# Altium schematic sheet Common_Mode_Filter.SchDoc
size A4
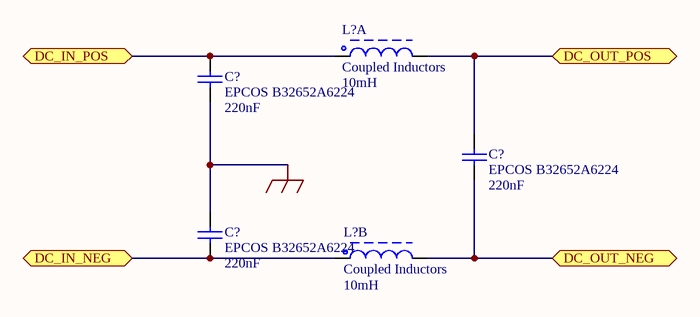
[diagram p0: Common_Mode_Filter.SchDoc]

## Parts
(Parts that share a designator on the sheet are numbered #1, #2 ... from top to bottom, then left to right.)
C?#1  EPCOS B32652A6224  value 220nF  [MKP  pitch:15mm size:11mm x 18mm]
C?#2  EPCOS B32652A6224  value 220nF  [MKP  pitch:15mm size:11mm x 18mm]
C?#3  EPCOS B32652A6224  value 220nF  [MKP  pitch:15mm size:11mm x 18mm]
L?#1  Coupled Inductors  value 10mH  [Bourns 8108-RC]  (part A of 2)
L?#2  Coupled Inductors  value 10mH  [Bourns 8108-RC]  (part B of 2)

## Ports
DC_IN_NEG (bidir), DC_IN_POS (bidir), DC_OUT_NEG (bidir), DC_OUT_POS (bidir)

## Nets
EARTH: C?#1.1 C?#3.2
DC_IN_NEG: C?#3.1 L?#2.4 ; port DC_IN_NEG
DC_IN_POS: C?#1.2 L?#1.1 ; port DC_IN_POS
DC_OUT_NEG: C?#2.1 L?#2.3 ; port DC_OUT_NEG
DC_OUT_POS: C?#2.2 L?#1.2 ; port DC_OUT_POS

## Library data of the parts
C?#1-C?#3 = EPCOS B32652A6224: MKP High Pulse (Wound) 220nF 630Vdc; Published: 8-Jun-2000; LatestRevisionDate: 17-Jul-2002; LatestRevisionNote: Re-released for DXP Platform.; PackageReference: RAD-0.3; Publisher: Altium Limited; PackageDescription: Radial Cap, Thru-Hole; 2 Leads; 0.3 in Pin Spacing
L?#1 L?#2 = Common mode filter 10A: Common mode filter; Code_IEC: 1005; Published: 8-Jun-2000; LatestRevisionDate: 29-May-2009; LatestRevisionNote: IPC-7351 Footprint Added.; PackageReference: 0402-A; Publisher: Altium Limited; PackageDescription: Chip Inductor; Code_JEITA: 0402